# Altium schematic sheet SheetArduinoUSB.SchDoc
size A4
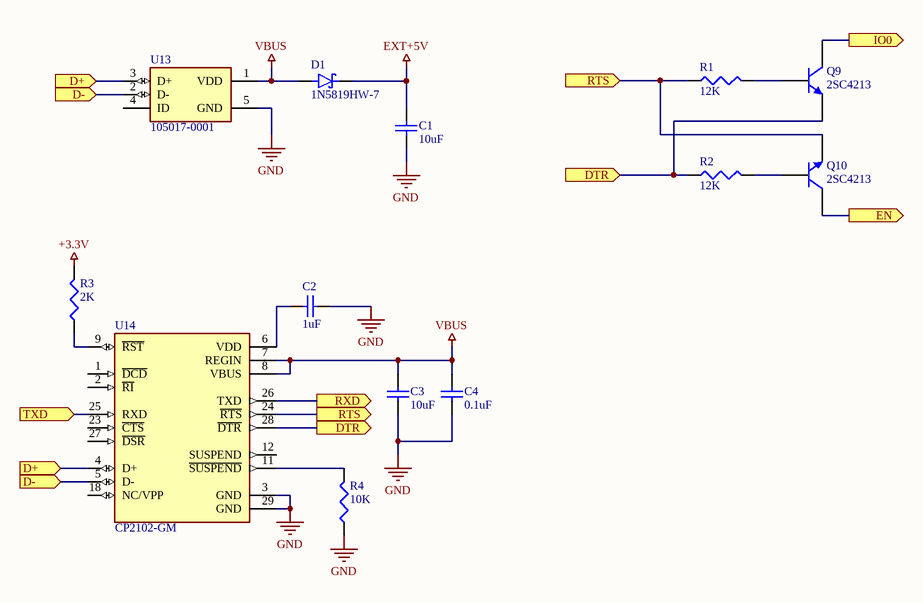
[diagram p0: SheetArduinoUSB.SchDoc]

## Parts
C1  10uF  [C1206]
C2  1uF  [1608[0603]]
C3  10uF  [C1206]
C4  0.1uF  [1608[0603]]
D1  1N5819HW-7  [SOD3715X145N]
Q9  2SC4213  [SOT-23B_N]
Q10  2SC4213  [SOT-23B_N]
R1  12K  [J1-0603]
R2  12K  [J1-0603]
R3  2K  [J1-0603]
R4  10K  [J1-0603]
U13  105017-0001  [MOLEX_105017-0001]
U14  CP2102-GM  [QFN50P500X500X100-29N]

## Ports
D+ (in), D- (in), DTR (in), DTR (out), EN (out), IO0 (out), RTS (in), RTS (out), RXD (out), TXD (in)

## Nets
+3.3V: R3.2
EXT+5V: C1.2 D1.C(K)
GND: C1.1 C2.1 C3.1 C4.1 R4.1 U13.5(GND) U14.3(GND) U14.29(GND)
VBUS: C3.2 C4.2 D1.A U13.1(VDD) U14.7(REGIN) U14.8(VBUS)
D+: U13.3(D+) U14.4(D+) ; port D+
D-: U13.2(D-) U14.5(D-) ; port D-
DTR: Q9.3(E) R2.1 U14.28(~{DTR}) ; port DTR
EN: Q10.1(C) ; port EN
IO0: Q9.1(C) ; port IO0
RTS: Q10.3(E) R1.1 U14.24(~{RTS}) ; port RTS
RXD: U14.26(TXD) ; port RXD
TXD: U14.25(RXD) ; port TXD
NetC2_2: C2.2 U14.6(VDD)
NetQ9_2: Q9.2(B) R1.2
NetQ10_2: Q10.2(B) R2.2
NetR3_1: R3.1 U14.9(~{RST})
NetR4_2: R4.2 U14.11(~{SUSPEND})

Not connected (* = marked no-connect by the designer): U13 4(ID); U14 1(~{DCD}) 2(~{RI}) 12(SUSPEND) 18(NC/VPP) 23(~{CTS}) 27(~{DSR})

## Library data of the parts
C1-C4 = Cap Semi: Capacitor (Semiconductor SIM Model); Published: 8-Jun-2000; LatestRevisionDate: 29-May-2009; LatestRevisionNote: IPC-7351 Footprint Added.; PackageReference: C1206; Publisher: Altium Limited; PackageDescription: Chip Capacitor
D1 = 1N5819HW-7: Diode Schottky 40 V 1A Surface Mount SOD-123; MF: Diodes Inc.; SnapEDA_Link: https://www.snapeda.com/parts/1N5819HW-7/Diodes+Inc./view-part/?ref=snap; Price: None; Check_prices: https://www.snapeda.com/parts/1N5819HW-7/Diodes+Inc./view-part/?ref=eda; Availability: In Stock; Value: *; MP: 1N5819HW-7; Package: SOD-123 Fairchild Semiconductor; Purchase-URL: https://pricing.snapeda.com/search/part/1N5819HW-7/?ref=eda
Q9 Q10 = QNPN: NPN Bipolar Transistor; Published: 8-Jun-2000; LatestRevisionDate: 29-May-2009; LatestRevisionNote: IPC-7351 Footprint Added.; PackageVersion: Aug-1999; PackageReference: SOT-23B; Publisher: Altium Limited; PackageDescription: 3-Pin SOT-23 Package 0.95 mm Pitch, 2.4 mm Lead Span
R1-R4 = Res3: Resistor; Published: 8-Jun-2000; LatestRevisionDate: 29-May-2009; LatestRevisionNote: IPC-7351 Footprint Added.; PackageReference: J1-0603; Publisher: Altium Limited; PackageDescription: Chip Resistor
U13 = 105017-0001: USB - micro B USB 2.0 Receptacle Connector 5 Position Surface Mount, Right Angle; Through Hole; MF: Molex; Price: None; Package: None; MP: 105017-0001; Value: *; Availability: Unavailable; SnapEDA_Link: https://www.snapeda.com/parts/105017-0001/Molex/view-part/281210/?ref=snap
U14 = CP2102-GM: USB Bridge, USB to UART USB 2.0 UART Interface 28-QFN _5x5_; MF: Silicon Labs; Package: QFN-28 Silicon Labs; Value: *; Price: None; MP: CP2102-GM; Availability: Unavailable; SnapEDA_Link: https://www.snapeda.com/parts/CP2102-GM/Silicon%20Labs/view-part/135876/?ref=snap